# EAGLE design CAN_toolboard_redesign (EAGLE 9.6.2)
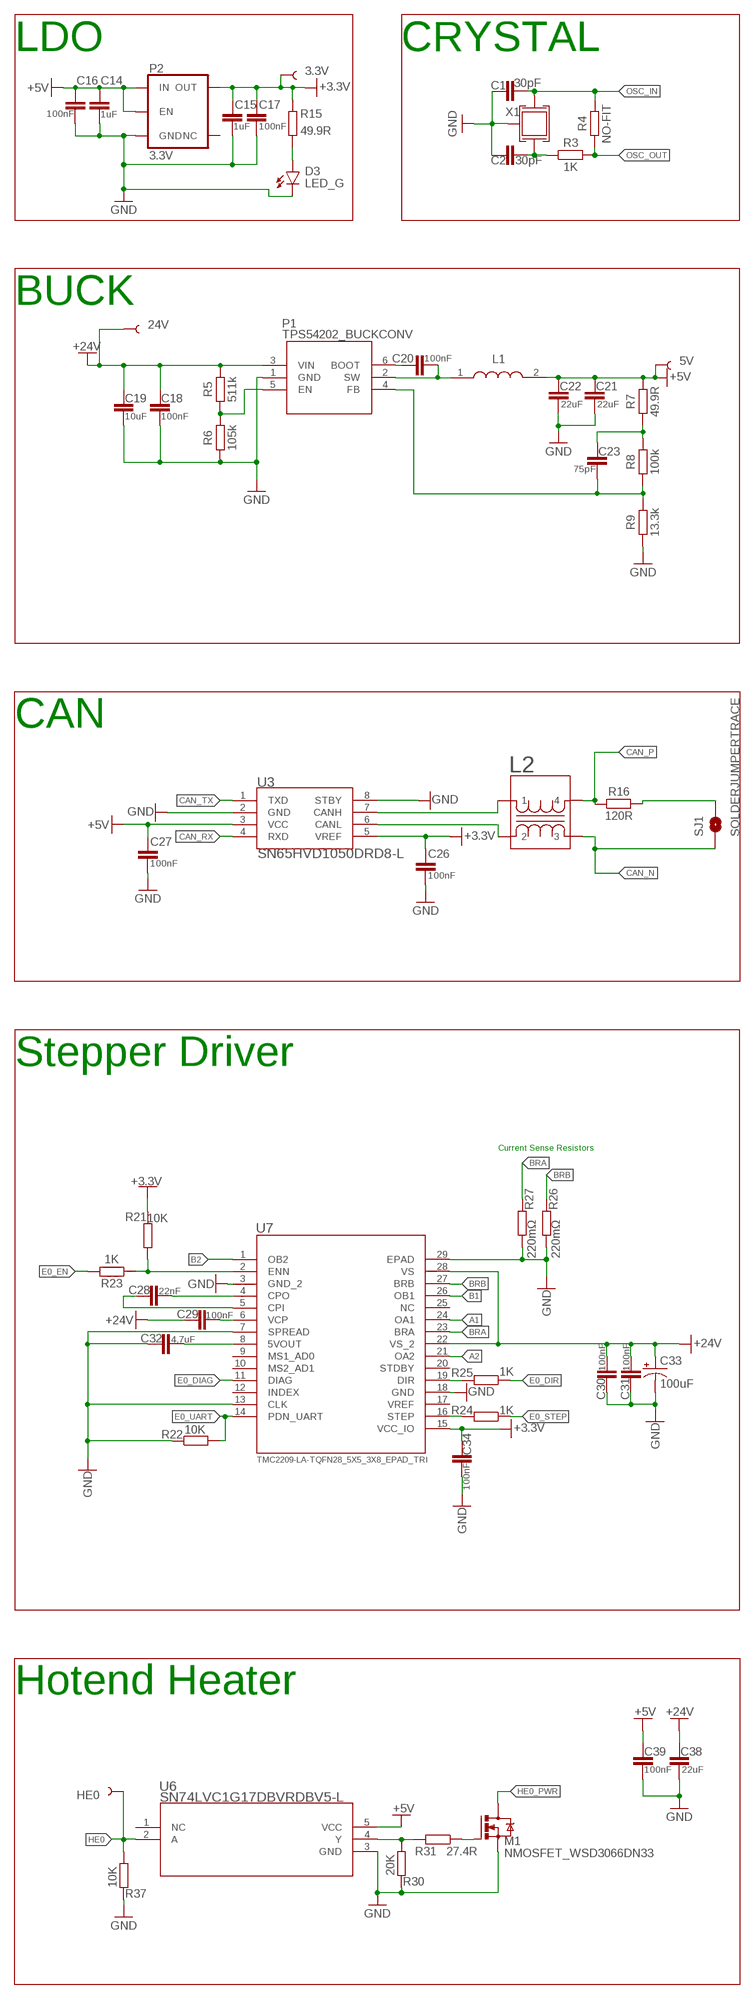
[diagram p0: schematic, sheet 1, part 1 of 2]
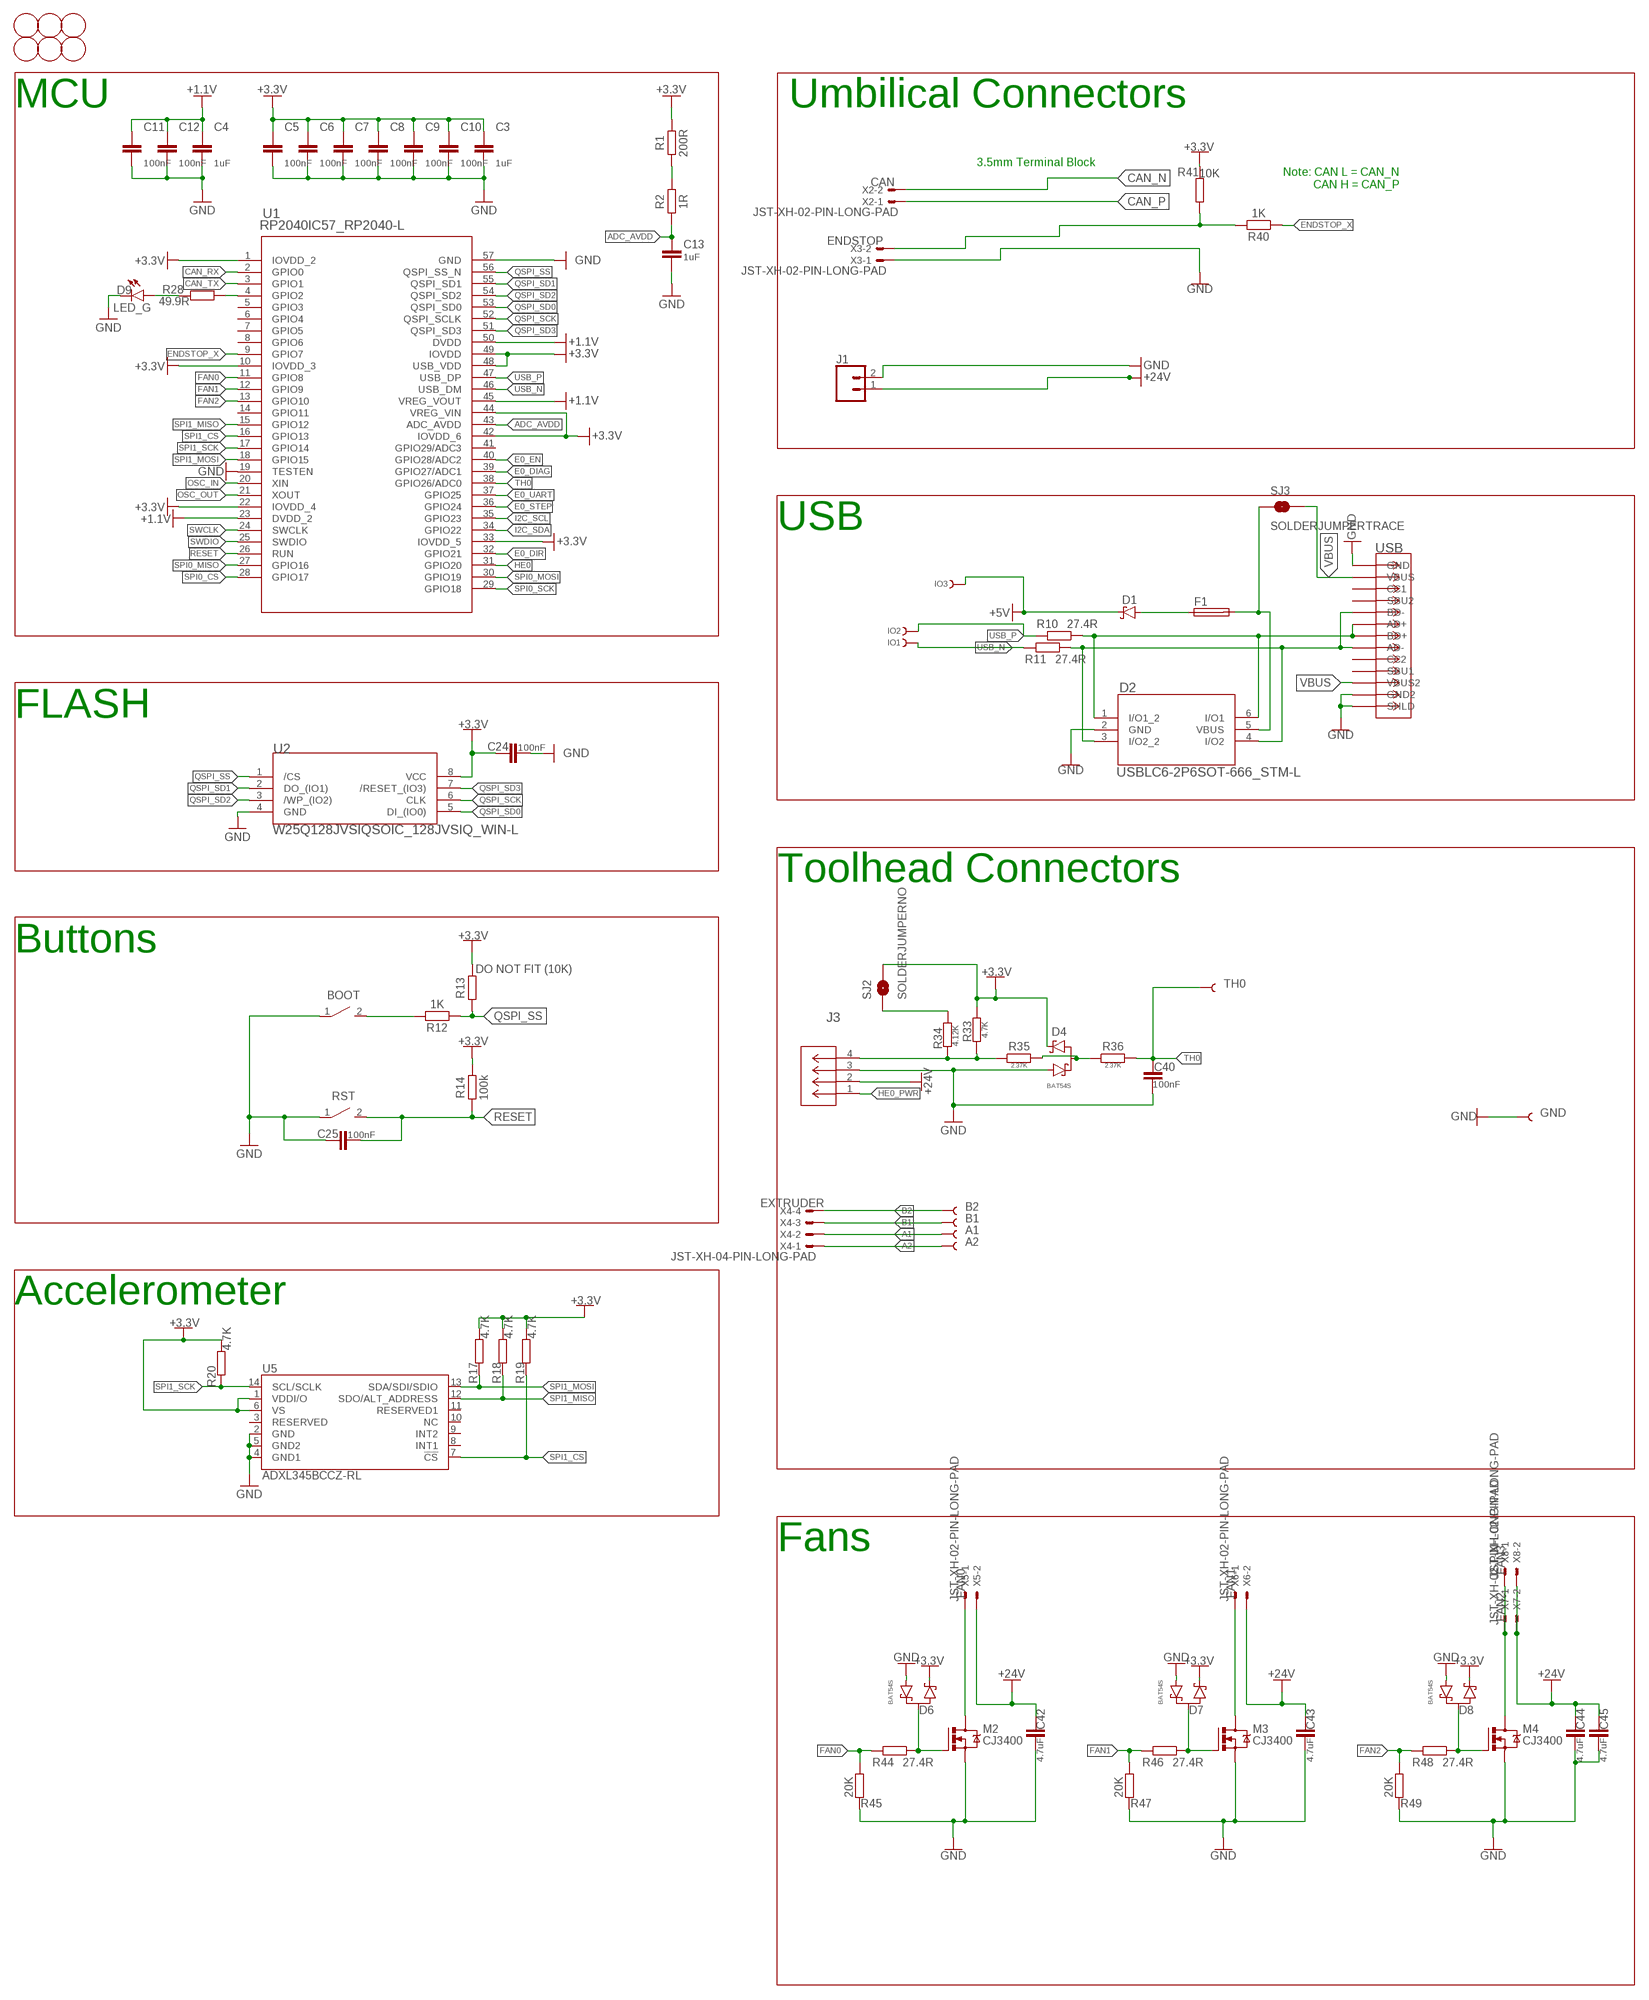
[diagram p1: schematic, sheet 1, part 2 of 2]

## Parts
3.3V  TEST-POINT3X4  [PAD.03X.04]
5V  TEST-POINT3X4  [PAD.03X.04]
24V  TEST-POINT3X4  [PAD.03X.04]
A1  TEST-POINT3X4  [PAD.03X.04]
A2  TEST-POINT3X4  [PAD.03X.04]
B1  TEST-POINT3X4  [PAD.03X.04]
B2  TEST-POINT3X4  [PAD.03X.04]
BOOT  B3U-1000P(M)-B  B3U-X000B3U-1000P(M)-B1000P(M)-B  [B3U-1000P(M)-B]
C1  30pF  C_CHIP-0402(1005-METRIC)  [CAPC1005X60]
C2  30pF  C_CHIP-0402(1005-METRIC)  [CAPC1005X60]
C3  1uF  C_CHIP-0402(1005-METRIC)  [CAPC1005X60]
C4  1uF  C_CHIP-0402(1005-METRIC)  [CAPC1005X60]
C5  100nF  C_CHIP-0402(1005-METRIC)  [CAPC1005X60]
C6  100nF  C_CHIP-0402(1005-METRIC)  [CAPC1005X60]
C7  100nF  C_CHIP-0402(1005-METRIC)  [CAPC1005X60]
C8  100nF  C_CHIP-0402(1005-METRIC)  [CAPC1005X60]
C9  100nF  C_CHIP-0402(1005-METRIC)  [CAPC1005X60]
C10  100nF  C_CHIP-0402(1005-METRIC)  [CAPC1005X60]
C11  100nF  C_CHIP-0402(1005-METRIC)  [CAPC1005X60]
C12  100nF  C_CHIP-0402(1005-METRIC)  [CAPC1005X60]
C13  1uF  C_CHIP-0402(1005-METRIC)  [CAPC1005X60]
C14  1uF  C_CHIP-0402(1005-METRIC)  [CAPC1005X60]
C15  1uF  C_CHIP-0402(1005-METRIC)  [CAPC1005X60]
C16  100nF  C_CHIP-0402(1005-METRIC)  [CAPC1005X60]
C17  100nF  C_CHIP-0402(1005-METRIC)  [CAPC1005X60]
C18  100nF  C_CHIP-0402(1005-METRIC)  [CAPC1005X60]
C19  10uF  C_CHIP-0603(1608-METRIC)  [CAPC1608X85]
C20  100nF  C_CHIP-0402(1005-METRIC)  [CAPC1005X60]
C21  22uF  C_CHIP-0805(2012-METRIC)  [CAPC2012X110]
C22  22uF  C_CHIP-0805(2012-METRIC)  [CAPC2012X110]
C23  75pF  C_CHIP-0402(1005-METRIC)  [CAPC1005X60]
C24  100nF  C_CHIP-0402(1005-METRIC)  [CAPC1005X60]
C25  100nF  C_CHIP-0402(1005-METRIC)  [CAPC1005X60]
C26  100nF  C_CHIP-0402(1005-METRIC)  [CAPC1005X60]
C27  100nF  C_CHIP-0402(1005-METRIC)  [CAPC1005X60]
C28  22nF  C_CHIP-0402(1005-METRIC)  [CAPC1005X60]
C29  100nF  C_CHIP-0402(1005-METRIC)  [CAPC1005X60]
C30  100nF  C_CHIP-0402(1005-METRIC)  [CAPC1005X60]
C31  100nF  C_CHIP-0402(1005-METRIC)  [CAPC1005X60]
C32  4.7uF  C_CHIP-0603(1608-METRIC)  [CAPC1608X85]
C33  100uF  100UF-POLAR-25V-20%(ELEC)  [PANASONIC_D]
C34  100nF  C_CHIP-0402(1005-METRIC)  [CAPC1005X60]
C38  22uF  C_CHIP-0805(2012-METRIC)  [CAPC2012X110]
C39  100nF  C_CHIP-0402(1005-METRIC)  [CAPC1005X60]
C40  100nF  C_CHIP-0402(1005-METRIC)  [CAPC1005X60]
C42  4.7uF  C_CHIP-0603(1608-METRIC)  [CAPC1608X85]
C43  4.7uF  C_CHIP-0603(1608-METRIC)  [CAPC1608X85]
C44  4.7uF  C_CHIP-0603(1608-METRIC)  [CAPC1608X85]
C45  4.7uF  C_CHIP-0603(1608-METRIC)  [CAPC1608X85]
D1  MBR0520LT1G  SCHOTTKY_MBR0520LT1GDO-219  [SODFL3718X115]
D2  USBLC6-2P6SOT-666_STM-L  [SOT-666_STM-L]
D3  LED_G  CHIP-FLAT-G_0603-0.35MM  [LEDC1608X35N_FLAT-G]
D4  BAT54S  [SOT23]
D6  BAT54S  [SOT23]
D7  BAT54S  [SOT23]
D8  BAT54S  [SOT23]
D9  LED_G  CHIP-FLAT-G_0603-0.35MM  [LEDC1608X35N_FLAT-G]
F1  FUSE_CHIP-0603(1608-METRIC)  [FUSC1608X60N]
FD1  FIDUCIAL  [FIDUCIAL_1MM]
FD2  FIDUCIAL  [FIDUCIAL_1MM]
FD3  FIDUCIAL  [FIDUCIAL_1MM]
FD4  FIDUCIAL  [FIDUCIAL_1MM]
FD5  FIDUCIAL  [FIDUCIAL_1MM]
FD6  FIDUCIAL  [FIDUCIAL_1MM]
GND  TEST-POINT3X4  [PAD.03X.04]
HE0  TEST-POINT3X4  [PAD.03X.04]
IO1  TEST-POINT3  [PAD.03X.03]
IO2  TEST-POINT3  [PAD.03X.03]
IO3  TEST-POINT3  [PAD.03X.03]
J1  CONN_023.5MM  [SCREWTERMINAL-3.5MM-2]
J3  430450400CON_430450400_MOL  [CON_430450400_MOL]
L1  ASPI-0630HI-100M-T157X7X4  [SMDRI74-680MT]
L2  ACM2012-201-2P-T002ACM2012_TDK  [ACM2012_TDK]
M1  NMOSFET_WSD3066DN33  [NMOSFET_WSD3066DN33]
M2  CJ3400  NMOSFET_BSS123_SOT23-GSD  [SOT23]
M3  CJ3400  NMOSFET_BSS123_SOT23-GSD  [SOT23]
M4  CJ3400  NMOSFET_BSS123_SOT23-GSD  [SOT23]
P1  TPS54202_BUCKCONV  [SOT-23-6]
P2  3.3V  V_REG_AP2112K-3.3V  [SOT23-5]
R1  200R  R_CHIP-0402(1005-METRIC)  [RESC1005X40]
R2  1R  R_CHIP-0402(1005-METRIC)  [RESC1005X40]
R3  1K  R_CHIP-0402(1005-METRIC)  [RESC1005X40]
R4  NO-FIT  R_CHIP-0402(1005-METRIC)  [RESC1005X40]
R5  511k  R_CHIP-0402(1005-METRIC)  [RESC1005X40]
R6  105k  R_CHIP-0402(1005-METRIC)  [RESC1005X40]
R7  49.9R  R_CHIP-0402(1005-METRIC)  [RESC1005X40]
R8  100k  R_CHIP-0402(1005-METRIC)  [RESC1005X40]
R9  13.3k  R_CHIP-0402(1005-METRIC)  [RESC1005X40]
R10  27.4R  R_CHIP-0402(1005-METRIC)  [RESC1005X40]
R11  27.4R  R_CHIP-0402(1005-METRIC)  [RESC1005X40]
R12  1K  R_CHIP-0402(1005-METRIC)  [RESC1005X40]
R13  DO NOT FIT (10K)  R_CHIP-0402(1005-METRIC)  [RESC1005X40]
R14  100k  R_CHIP-0402(1005-METRIC)  [RESC1005X40]
R15  49.9R  R_CHIP-0402(1005-METRIC)  [RESC1005X40]
R16  120R  R_CHIP-0402(1005-METRIC)  [RESC1005X40]
R17  4.7K  R_CHIP-0402(1005-METRIC)  [RESC1005X40]
R18  4.7K  R_CHIP-0402(1005-METRIC)  [RESC1005X40]
R19  4.7K  R_CHIP-0402(1005-METRIC)  [RESC1005X40]
R20  4.7K  R_CHIP-0402(1005-METRIC)  [RESC1005X40]
R21  10K  R_CHIP-0402(1005-METRIC)  [RESC1005X40]
R22  10K  R_CHIP-0402(1005-METRIC)  [RESC1005X40]
R23  1K  R_CHIP-0402(1005-METRIC)  [RESC1005X40]
R24  1K  R_CHIP-0402(1005-METRIC)  [RESC1005X40]
R25  1K  R_CHIP-0402(1005-METRIC)  [RESC1005X40]
R26  220mΩ  R_CHIP-0402(1005-METRIC)  [RESC1005X40]
R27  220mΩ  R_CHIP-0402(1005-METRIC)  [RESC1005X40]
R28  49.9R  R_CHIP-0402(1005-METRIC)  [RESC1005X40]
R30  20K  R_CHIP-0402(1005-METRIC)  [RESC1005X40]
R31  27.4R  R_CHIP-0402(1005-METRIC)  [RESC1005X40]
R33  4.7K  R_CHIP-0402(1005-METRIC)  [RESC1005X40]
R34  4.12K  R_CHIP-0402(1005-METRIC)  [RESC1005X40]
R35  2.37K  R_CHIP-0402(1005-METRIC)  [RESC1005X40]
R36  2.37K  R_CHIP-0402(1005-METRIC)  [RESC1005X40]
R37  10K  R_CHIP-0402(1005-METRIC)  [RESC1005X40]
R40  1K  R_CHIP-0402(1005-METRIC)  [RESC1005X40]
R41  10K  R_CHIP-0402(1005-METRIC)  [RESC1005X40]
R44  27.4R  R_CHIP-0402(1005-METRIC)  [RESC1005X40]
R45  20K  R_CHIP-0402(1005-METRIC)  [RESC1005X40]
R46  27.4R  R_CHIP-0402(1005-METRIC)  [RESC1005X40]
R47  20K  R_CHIP-0402(1005-METRIC)  [RESC1005X40]
R48  27.4R  R_CHIP-0402(1005-METRIC)  [RESC1005X40]
R49  20K  R_CHIP-0402(1005-METRIC)  [RESC1005X40]
RST  B3U-1000P(M)-B  B3U-X000B3U-1000P(M)-B1000P(M)-B  [B3U-1000P(M)-B]
SJ1  SOLDERJUMPERTRACE  [SJ_2S-TRACE]
SJ2  SOLDERJUMPERNO  [SJ_2S-NO]
SJ3  SOLDERJUMPERTRACE  [SJ_2S-TRACE]
TH0  TEST-POINT3X4  [PAD.03X.04]
U1  RP2040IC57_RP2040-L  [IC57_RP2040-L]
U2  W25Q128JVSIQSOIC_128JVSIQ_WIN-L  [SOIC_128JVSIQ_WIN-L]
U3  SN65HVD1050DRD8-L  [D8-L]
U5  ADXL345BCCZ-RL  [ADXL345_LGA14]
U6  SN74LVC1G17DBVRDBV5-L  [DBV5-L]
U7  TMC2209-LA-TQFN28_5X5_3X8_EPAD_TRI  [QFN28_5X5_3X8_EPAD_TRI]
USB  USB-C(DX07S016JA1R1500)  [CONN12_016JA1R1500_JAE]
X1  CRYSTAL_TAXM12M4RLBDDT2T_3225  [CRYSTAL_3225]
X2  JST-XH-02-PIN-LONG-PAD  [JST-XH-02-PACKAGE-LONG-PAD]
X3  JST-XH-02-PIN-LONG-PAD  [JST-XH-02-PACKAGE-LONG-PAD]
X4  JST-XH-04-PIN-LONG-PAD  [JST-XH-04-PACKAGE-LONG-PAD]
X5  JST-XH-02-PIN-LONG-PAD  [JST-XH-02-PACKAGE-LONG-PAD]
X6  JST-XH-02-PIN-LONG-PAD  [JST-XH-02-PACKAGE-LONG-PAD]
X7  JST-XH-02-PIN-LONG-PAD  [JST-XH-02-PACKAGE-LONG-PAD]
X8  JST-XH-02-PIN-LONG-PAD  [JST-XH-02-PACKAGE-LONG-PAD]

## Nets
+1.1V [POWER]: C4.1 C11.1 C12.1 U1.23(DVDD_2) U1.45(VREG_VOUT) U1.50(DVDD)
+3.3V [POWER]: 3.3V.P$1 C3.1 C5.1 C6.1 C7.1 C8.1 C9.1 C10.1 C15.1 C17.1 C24.1 C26.1 C34.1 D4.2 D6.2 D7.2 D8.2 P2.5(OUT) R1.2 R13.2 R14.2 R15.2 R17.2 R18.2 R19.2 R20.2 R21.1 R33.2 R41.1 SJ2.2 U1.1(IOVDD_2) U1.10(IOVDD_3) U1.22(IOVDD_4) U1.33(IOVDD_5) U1.42(IOVDD_6) U1.44(VREG_VIN) U1.48(USB_VDD) U1.49(IOVDD) U2.8(VCC) U3.5(VREF) U5.1(VDDI/O) U5.6(VS) U7.15(VCC_IO)
+5V [POWER]: 5V.P$1 C14.1 C16.1 C21.1 C22.1 C27.1 C39.1 D1.1(C) IO3.P$1 L1.2 P2.1(IN) P2.3(EN) R7.2 U3.3(VCC) U6.5(VCC)
+24V [POWER]: 24V.P$1 C18.1 C19.1 C29.1 C30.2 C31.2 C33.+ C38.1 C42.1 C43.1 C44.1 C45.1 J1.1 J3.2 P1.3(VIN) R5.2 U7.22(VS_2) U7.28(VS) X5.2 X6.2 X7.2 X8.2
A1 [POWER]: A1.P$1 U7.24(OA1) X4.2
A2 [POWER]: A2.P$1 U7.21(OA2) X4.1
ADC_AVDD: C13.1 R2.1 U1.43(ADC_AVDD)
ADC_R: R1.1 R2.2
B1 [POWER]: B1.P$1 U7.26(OB1) X4.3
B2 [POWER]: B2.P$1 U7.1(OB2) X4.4
BCBOOT: C20.1 P1.6(BOOT)
BRA: R27.2 U7.23(BRA)
BRB: R26.2 U7.27(BRB)
CAN1_N [DIFF]: L2.2 U3.6(CANL)
CAN1_P [DIFF]: L2.1 U3.7(CANH)
CAN_N [DIFF]: L2.3 SJ1.1 X2.2
CAN_P [DIFF]: L2.4 R16.1 X2.1
CAN_RX: U1.2(GPIO0) U3.4(RXD)
CAN_TX: U1.3(GPIO1) U3.1(TXD)
CNT: R16.2 SJ1.2
DIR: R25.2 U7.19(DIR)
E0_DIAG: U1.39(GPIO27/ADC1) U7.11(DIAG)
E0_DIR: R25.1 U1.32(GPIO21)
E0_EN: R23.2 U1.40(GPIO28/ADC2)
E0_STEP: R24.1 U1.36(GPIO24)
E0_UART: R22.2 U1.37(GPIO25) U7.14(PDN_UART)
ENDSTOP_X: R40.1 U1.9(GPIO7)
EX: R40.2 R41.2 X3.2
FAN0: R44.2 R45.2 U1.11(GPIO8)
FAN0G: D6.3 M2.1(G) R44.1
FAN1: R46.2 R47.2 U1.12(GPIO9)
FAN1D: M3.3(D) X6.1
FAN1G: D7.3 M3.1(G) R46.1
FAN2: R48.2 R49.2 U1.13(GPIO10)
FAN2G: D8.3 M4.1(G) R48.1
GND [POWER]: BOOT.1 C1.2 C2.1 C3.2 C4.2 C5.2 C6.2 C7.2 C8.2 C9.2 C10.2 C11.2 C12.2 C13.2 C14.2 C15.2 C16.2 C17.2 C18.2 C19.2 C21.2 C22.2 C24.2 C25.1 C26.2 C27.2 C30.1 C31.1 C32.1 C33.- C34.2 C38.2 C39.2 C40.2 C42.2 C43.2 C44.2 C45.2 D2.2(GND) D3.C D4.1 D6.1 D7.1 D8.1 D9.C GND.P$1 J1.2 J3.3 M1.P$1(S) M1.P$2(S) M1.P$3(S) M2.2(S) M3.2(S) M4.2(S) P1.1(GND) P2.2(GND) R6.1 R9.1 R22.1 R26.1 R27.1 R30.1 R37.1 R45.1 R47.1 R49.1 RST.1 U1.19(TESTEN) U1.57(GND) U2.4(GND) U3.2(GND) U3.8(STBY) U5.2(GND) U5.4(GND1) U5.5(GND2) U6.3(GND) U7.3(GND_2) U7.7(SPREAD) U7.13(CLK) U7.18(GND) U7.29(EPAD) USB.1(GND) USB.12(GND2) USB.13(SHLD) USB.14(SHLD) USB.15(SHLD) USB.16(SHLD) USB.18(SHLD) USB.19(SHLD) USB.20(SHLD) USB.21(SHLD) USB.24(SHLD) USB.25(SHLD) USB.26(SHLD) USB.27(SHLD) USB.28(SHLD) USB.29(SHLD) USB.37(SHLD) USB.39(SHLD) USB.41(SHLD) USB.43(SHLD) X1.P$2(GND) X1.P$4(GND) X3.1
GPIOLED: D9.A R28.1
HE0: HE0.P$1 R37.2 U1.31(GPIO20) U6.2(A)
HE0_PWR [POWER]: J3.1 M1.P$5(D) M1.P$6(D) M1.P$7(D) M1.P$8(D) M1.P$9(D)
HE0A: R30.2 R31.2 U6.4(Y)
HE0B: M1.P$4(G) R31.1
I2C_SCL: U1.35(GPIO23)
I2C_SDA: U1.34(GPIO22)
LDOLED: D3.A R15.1
LED: R28.2 U1.4(GPIO2)
N$1: M2.3(D) X5.1
N$2: M4.3(D) X7.1 X8.1
OSC_IN: C1.1 R4.2 U1.20(XIN) X1.P$1(P1)
OSC_OUT: R3.2 R4.1 U1.21(XOUT)
QSPI_SCK: U1.52(QSPI_SCLK) U2.6(CLK)
QSPI_SD0: U1.53(QSPI_SD0) U2.5(DI_(IO0))
QSPI_SD1: U1.55(QSPI_SD1) U2.2(DO_(IO1))
QSPI_SD2: U1.54(QSPI_SD2) U2.3(/WP_(IO2))
QSPI_SD3: U1.51(QSPI_SD3) U2.7(/RESET_(IO3))
QSPI_SS: R12.1 R13.1 U1.56(QSPI_SS_N) U2.1(/CS)
RESET: C25.2 R14.1 RST.2 U1.26(RUN)
SPI0_CS: U1.28(GPIO17)
SPI0_MISO: U1.27(GPIO16)
SPI0_MOSI: U1.30(GPIO19)
SPI0_SCK: U1.29(GPIO18)
SPI1_CS: R19.1 U1.16(GPIO13) U5.7(!CS)
SPI1_MISO: R18.1 U1.15(GPIO12) U5.12(SDO/ALT_ADDRESS)
SPI1_MOSI: R17.1 U1.18(GPIO15) U5.13(SDA/SDI/SDIO)
SPI1_SCK: R20.1 U1.17(GPIO14) U5.14(SCL/SCLK)
STEP: R24.2 U7.16(STEP)
SWB: BOOT.2 R12.2
SWCLK: U1.24(SWCLK)
SWDIO: U1.25(SWDIO)
TH0: C40.1 R36.2 TH0.P$1 U1.38(GPIO26/ADC0)
TH0A: J3.4 R33.1 R34.1 R35.1
TH0B: D4.3 R35.2 R36.1
TH0C: R34.2 SJ2.1
TMC5V: C32.2 U7.8(5VOUT)
TMCCPI: C28.1 U7.5(CPI)
TMCCPO: C28.2 U7.4(CPO)
TMCENN: R21.2 R23.1 U7.2(ENN)
TMCVCP: C29.2 U7.6(VCP)
USB1_N [DIFF]: D2.3(I/O2_2) D2.4(I/O2) R11.1 USB.5(BD-) USB.8(AD-)
USB1_P [DIFF]: D2.1(I/O1_2) D2.6(I/O1) R10.1 USB.6(AD+) USB.7(BD+)
USB_N [DIFF]: IO1.P$1 R11.2 U1.46(USB_DM)
USB_P [DIFF]: IO2.P$1 R10.2 U1.47(USB_DP)
VBUS [POWER]: SJ3.2 USB.2(VBUS) USB.11(VBUS2)
VBUS1 [POWER]: D2.5(VBUS) F1.2 SJ3.1
VBUS2 [POWER]: D1.2(A) F1.1
VRC: C23.1 R7.1 R8.2
VREGEN: P1.5(EN) R5.1 R6.2
VREGFB: C23.2 P1.4(FB) R8.1 R9.2
VREGO: C20.2 L1.1 P1.2(SW)
XR: C2.2 R3.1 X1.P$3(P2)
Unconnected: P2.4(NC) U1.5(GPIO3) U1.6(GPIO4) U1.7(GPIO5) U1.8(GPIO6) U1.14(GPIO11) U1.41(GPIO29/ADC3) U5.3(RESERVED) U5.8(INT1) U5.9(INT2) U5.10(NC) U5.11(RESERVED1) U6.1(NC) U7.9(MS1_AD0) U7.10(MS2_AD1) U7.12(INDEX) U7.17(VREF) U7.20(STDBY) U7.25(NC) USB.3(CC1) USB.4(SBU2) USB.9(CC2) USB.10(SBU1)

## Notes on the sheet
- LDO | CRYSTAL | MCU | Umbilical Connectors
- 3.5mm Terminal Block
- Note: CAN L = CAN_N
  CAN H = CAN_P
- BUCK
- USB
- FLASH
- CAN
- Toolhead Connectors
- Buttons
- Stepper Driver
- Current Sense Resistors
- Accelerometer
- Fans
- Hotend Heater

## Library data of the parts
3.3V 5V 24V A1 A2 B1 B2 GND HE0 IO1-IO3 TH0 = SparkFun-Connectors:TEST-POINT: SparkFun Test Points Bare copper test points for troubleshooting or In-Circuit-Testing. These are used by our Production team for verifying production board runs using pogo-pins on test beds. SparkFun Products: SparkFun LSM9DS1 Breakout <https://www.sparkfun.com/products/13284> SparkFun PSOC <https://www.sparkfun.com/products/13714> SparkFun Load Cell Amplifier <https://www.sparkfun.com/products/13879>
BOOT RST = Switch:B3U-X000: Ultra-small Tactile Switch Contact form : SPST-NO Datasheet <https://omronfs.omron.com/en_US/ecb/products/pdf/en-b3u.pdf>; CATEGORY: SWITCH; DESCRIPTION: Ultra-small Surface-mounting Tactile Switches with High Contact Reliability; LCSCPN#: C231329; MANUFACTURER: OMRON; OPERATING_TEMPERATURE: -25°C to +70°C at 60%RH max; PART_STATUS: ACTIVE; SERIES: B3U; TYPE: Tactile
C1 C2 = Fracktal Misc Lib:C: Capacitor - Generic; CATEGORY: Capacitor; LCSCPN#: C1570
C3 C4 C13-C15 = Fracktal Misc Lib:C: Capacitor - Generic; CATEGORY: Capacitor; LCSCPN#: C52923
C5-C12 C16-C18 C20 C24-C27 C29-C31 C34 C39 C40 = Fracktal Misc Lib:C: Capacitor - Generic; CATEGORY: Capacitor; LCSCPN#: C307331
C19 = Fracktal Misc Lib:C: Capacitor - Generic; CATEGORY: Capacitor; LCSCPN#: C194427
C21 C22 C38 = Fracktal Misc Lib:C: Capacitor - Generic; CATEGORY: Capacitor; LCSCPN#: C338080
C23 = Fracktal Misc Lib:C: Capacitor - Generic; CATEGORY: Capacitor; LCSCPN#: C37809
C28 = Fracktal Misc Lib:C: Capacitor - Generic; CATEGORY: Capacitor; LCSCPN#: C1532
C32 C42-C45 = Fracktal Misc Lib:C: Capacitor - Generic; CATEGORY: Capacitor; LCSCPN#: C162274
C33 = Fracktal Misc Lib:100UF-POLAR: 100µF polarized capacitors A capacitor is a passive two-terminal electrical component used to store electrical energy temporarily in an electric field.; LCSCPN#: C128464; PROD_ID: CAP-12547
D1 = Diode:SCHOTTKY_: Schottky Diode - Popular parts; CATEGORY: Diode; DESCRIPTION: DIODE SCHOTTKY 20V 500MA SOD123; MANUFACTURER: ON Semiconductor; MPN: MBR0520LT1G; SUB-CATEGORY: Schottky
D2 = 2023-04-02_04-17-07_Library:USBLC6-2P6; COPYRIGHT: Copyright (C) 2023 Ultra Librarian. All rights reserved.; LCSCPN#: C2827693; MANUFACTURER_PART_NUMBER: USBLC6-2P6; MFR_NAME: STMicroelectronics
D3 D9 = LED:CHIP-FLAT-G; CATEGORY: LED; COLOR: GREEN; DESCRIPTION: CHIP LED FLAT; LCSCPN#: C72043; SUB-CATEGORY: CHIP; TYPE: FLAT_TOP; VALUE: LED_GREEN
D4 D6-D8 = Fracktal Misc Lib:BAT54S; LCSCPN#: C47546
F1 = Circuit-Protection:FUSE: Fuse - Generic; CATEGORY: Circuit-Protection; LCSCPN#: C261937; SUB-CATEGORY: Fuse
FD1-FD6 = CDC Library:FIDUCIAL: For use by pick and place machines to calibrate the vision/machine, 1mm By microbuilder.eu
J1 = SparkFun-Connectors:CONN_02: Multi connection point. Often used as Generic Header-pin footprint for 0.1 inch spaced/style header connections On any of the 0.1 inch spaced packages, you can populate with these: Break Away Headers - Straight <https://www.sparkfun.com/products/116> (PRT-00116) Break Away Male Headers - Right Angle <https://www.sparkfun.com/products/553> (PRT-00553) Female Headers <https://www.sparkfun.com/products/115> (PRT-00115) Break Away Headers - Machine Pin <https://www.sparkfun.com/products/117> (PRT-00117) Break Away Female Headers - Swiss Machine Pin <https://www.sparkfun.com/products/743> (PRT-00743) For SCREWTERMINALS and SPRING TERMINALS visit here: Screw Terimnals on SparkFun.com <https://www.sparkfun.com/search/results?term=Screw+Terminals> (5mm/3.5mm/2.54mm spacing) This device is also useful as a general connection point to wire up your design to another part of your project. Our various solder wires solder well into these plated through hole pads. Hook-Up Wire - Assortment (Stranded, 22 AWG) <https://www.sparkfun.com/products/11375> (PRT-11375) Hook-Up Wire - Assortment (Solid Core, 22 AWG) <https://www.sparkfun.com/products/11367> (PRT-11367) View the entire wire category on our website here <https://www.sparkfun.com/categories/141> Special notes: Molex polarized connector foot print use with: PRT-08233 with associated crimp pins and housings. 2.54_SCREWTERM for use with PRT-10571. 3.5mm Screw Terminal footprints for PRT-08084 5mm Screw Terminal footprints for use with PRT-08432; PROD_ID: CONN-08399
J3 = Fracktal Misc Lib:430450400; COPYRIGHT: Copyright (C) 2023 Ultra Librarian. All rights reserved.; MANUFACTURER_PART_NUMBER: 430450400; MFR_NAME: Molex Connector Corporation
L1 = Fracktal Misc Lib:ASPI-0630HI-100M-T15: Inductor Power Molded Wirewound 10uH 20% 3A 105mOhm DCR T/R Source: Datasheet <https://www.arrow.com/en/products/aspi-0630hi-100m-t15/abracon>; LCSCPN#: C3000391
L2 = 2023-04-02_14-21-16_Library:ACM2012-201-2P-T002; COPYRIGHT: Copyright (C) 2023 Ultra Librarian. All rights reserved.; LCSCPN#: C3029258; MANUFACTURER_PART_NUMBER: ACM2012-201-2P-T002; MFR_NAME: TDK
M1 = Fracktal Misc Lib:NMOSFET_WSD3066DN33; LCSCPN#: C148386
M2-M4 = Transistor:NMOSFET_: N-Channel MOSFET - Popular parts; CATEGORY: Transistor; DESCRIPTION: MOSFET N-CH 100V 0.17A SOT-23; DRAIN_CURRENT: 170mA; LCSCPN#: C19019; MANUFACTURER: ON Semiconductor; MPN: BSS123L; OPERATING_TEMP: -55°C ~ 150°C; PART_STATUS: Active; ROHS_COMPLIANT: Yes; SUB-CATEGORY: MOSFET; THERMALLOSS: 360mW; TYPE: N-Channel; VALUE: BSS123
P1 = Fracktal Misc Lib:TPS54202_BUCKCONV; LCSCPN#: C191884
P2 = SparkFun-IC-Power:V_REG_AP2112: AP2112 - 600mA CMOS LDO Regulator w/ Enable The AP2112 is CMOS process low dropout linear regulator with enable function, the regulator delivers a guaranteed 600mA (min.) continuous load current. Features Output Voltage Accuracy: ±1.5% Output Current: 600mA (Min.) Foldback Short Current Protection: 50mA Enable Function to Turn ON/OFF VOUT Low Dropout Voltage (3.3V): 250mV (Typ.) @IOUT=600mA Excellent Load Regulation: 0.2%/A (Typ.) Excellent Line Regulation: 0.02%/V (Typ.) Low Quiescent Current: 55μA (Typ.) Low Standby Current: 0.01μA (Typ.) Low Output Noise: 50μVRMS PSRR: 100Hz -65dB, 1kHz -65dB OTSD Protection Stable with 1.0μF Flexible Cap: Ceramic, Tantalum and Aluminum Electrolytic Operation Temperature Range: -40°C to 85°C ESD: MM 400V, HBM 4000V; LCSCPN#: C51118; PROD_ID: VREG-12457
R1 = Fracktal Misc Lib:R: Resistor Fixed - Generic; CATEGORY: Resistor; LCSCPN#: C25087; SUB-CATEGORY: Fixed
R2 = Fracktal Misc Lib:R: Resistor Fixed - Generic; CATEGORY: Resistor; LCSCPN#: C25086; SUB-CATEGORY: Fixed
R3 R12 R23-R25 R40 = Fracktal Misc Lib:R: Resistor Fixed - Generic; CATEGORY: Resistor; LCSCPN#: C25543; SUB-CATEGORY: Fixed
R4 R13 = Fracktal Misc Lib:R: Resistor Fixed - Generic; CATEGORY: Resistor; LCSCPN#: NO-FIT; SUB-CATEGORY: Fixed
R5 = Fracktal Misc Lib:R: Resistor Fixed - Generic; CATEGORY: Resistor; LCSCPN#: C3037035; SUB-CATEGORY: Fixed
R6 = Fracktal Misc Lib:R: Resistor Fixed - Generic; CATEGORY: Resistor; LCSCPN#: C2933067; SUB-CATEGORY: Fixed
R7 R15 R28 = Fracktal Misc Lib:R: Resistor Fixed - Generic; CATEGORY: Resistor; LCSCPN#: C25120; SUB-CATEGORY: Fixed
R8 R14 = Fracktal Misc Lib:R: Resistor Fixed - Generic; CATEGORY: Resistor; LCSCPN#: C25741; SUB-CATEGORY: Fixed
R9 = Fracktal Misc Lib:R: Resistor Fixed - Generic; CATEGORY: Resistor; LCSCPN#: C2974007; SUB-CATEGORY: Fixed
R10 R11 R31 R44 R46 R48 = Fracktal Misc Lib:R: Resistor Fixed - Generic; CATEGORY: Resistor; LCSCPN#: C31439; SUB-CATEGORY: Fixed
R16 = Fracktal Misc Lib:R: Resistor Fixed - Generic; CATEGORY: Resistor; LCSCPN#: C25079; SUB-CATEGORY: Fixed
R17-R20 R33 = Fracktal Misc Lib:R: Resistor Fixed - Generic; CATEGORY: Resistor; LCSCPN#: C304616; SUB-CATEGORY: Fixed
R21 R22 R37 R41 = Fracktal Misc Lib:R: Resistor Fixed - Generic; CATEGORY: Resistor; LCSCPN#: C25744; SUB-CATEGORY: Fixed
R26 R27 = Fracktal Misc Lib:R: Resistor Fixed - Generic; CATEGORY: Resistor; LCSCPN#: C705474; SUB-CATEGORY: Fixed
R30 R45 R47 R49 = Fracktal Misc Lib:R: Resistor Fixed - Generic; CATEGORY: Resistor; LCSCPN#: C25765; SUB-CATEGORY: Fixed
R34 = Fracktal Misc Lib:R: Resistor Fixed - Generic; CATEGORY: Resistor; LCSCPN#: C227106; SUB-CATEGORY: Fixed
R35 R36 = Fracktal Misc Lib:R: Resistor Fixed - Generic; CATEGORY: Resistor; LCSCPN#: C425373; SUB-CATEGORY: Fixed
SJ1-SJ3 = SparkFun-Retired:SOLDERJUMPER: Solder Jumper Standard SMD solder jumper. Used to automate production. Two varients : Normally Open and Normally Closed are the same, but have different paste layers. NC will have a large amount of paste and should jumper during reflow.
U1 = 2023-03-26_17-59-48_Library:RP2040; COPYRIGHT: Copyright (C) 2023 Ultra Librarian. All rights reserved.; LCSCPN#: C2040; MANUFACTURER_PART_NUMBER: RP2040; MFR_NAME: Raspberry Pi
U2 = Fracktal Misc Lib:W25Q128JVSIQ; COPYRIGHT: Copyright (C) 2023 Ultra Librarian. All rights reserved.; LCSCPN#: C97521; MANUFACTURER_PART_NUMBER: W25Q128JVSIQ; MFR_NAME: Winbond
U3 = Fracktal Misc Lib:SN65HVD1050DR; COPYRIGHT: Copyright (C) 2023 Ultra Librarian. All rights reserved.; LCSCPN#: C14019; MANUFACTURER_PART_NUMBER: SN65HVD1050DR; MFR_NAME: Texas Instruments
U5 = Sensor:ADXL345: Digital Accelerometer Datasheet <https://www.analog.com/media/en/technical-documentation/data-sheets/ADXL345.pdf>; CATEGORY: SENSOR; DESCRIPTION: Digital Accelerometer; LCSCPN#: C9667; MANUFACTURER: ANALOG DEVICES; MPN: ADXL345BCCZ-RL; OPERATING_TEMPERATURE: −55°C to +105°C; PART_STATUS: ACTIVE; ROHS_COMPLIANT: RoHS Compliant; SERIES: ADXL345; SUB-CATEGORY: Accelerometer; TYPE: 3-Axis Digital MEMS Accelerometer
U6 = 2023-03-28_15-41-49_Library:SN74LVC1G17DBVR; COPYRIGHT: Copyright (C) 2023 Ultra Librarian. All rights reserved.; LCSCPN#: C7836; MANUFACTURER_PART_NUMBER: SN74LVC1G17DBVR; MFR_NAME: Texas Instruments
U7 = Fracktal Misc Lib:TMC2209-LA-T; COPYRIGHT: Copyright (C) 2023 Ultra Librarian. All rights reserved.; DIGI-KEY_PART_NUMBER_1: 1460-1398-2-ND; DIGI-KEY_PART_NUMBER_2: 1460-1398-1-ND; DIGI-KEY_PART_NUMBER_3: 1460-1398-6-ND; DIGI-KEY_PART_NUMBER_4: 1460-TMC2209-LA-TTR-NDL; LCSCPN#: C2150710; MANUFACTURER_PART_NUMBER: TMC2209-LA-T; MFR_NAME: Trinamic
USB = CDC Library:USB-C(DX07S016JA1R1500); BUILT_BY: EMA_Matt; COPYRIGHT: Copyright (C) 2018 Accelerated Designs. All rights reserved; DATASHEET: https://www.digikey.com/product-detail/en/DX07S016JA1R1500/670-DX07S016JA1R1500CT-ND/11586676?utm_campaign=buynow&WT.z_cid=ref_octopart_dkc_buynow&utm_medium=aggregator&curr=usd&site=us&utm_source=octopart; LCSCPN#: C709357; MANUFACTURER_PART_NUMBER: DX07S016JA1R1500; SOURCELIBRARY: JAE_Electronics_2020-03-30; VENDOR: JAE Electronics
X1 = Fracktal Misc Lib:CRYSTAL_TAXM12M4RLBDDT2T_3225; LCSCPN#: C133334
X2 X3 X5-X8 = Rembrandt Electronics - JST XH Connectors v1-0:JST-XH-02-PIN: JST XH Connector 2 Pin Wire to board connector. Pitch: 2,54 mm, (0.100") Number of pins: 2 Created by Rembrandt Electronics www.rembrandtelectronics.com
X4 = Rembrandt Electronics - JST XH Connectors v1-0:JST-XH-04-PIN: JST XH Connector 2 Pin Wire to board connector. Pitch: 2,54 mm, (0.100") Number of pins: 4 Created by Rembrandt Electronics www.rembrandtelectronics.com

## Board
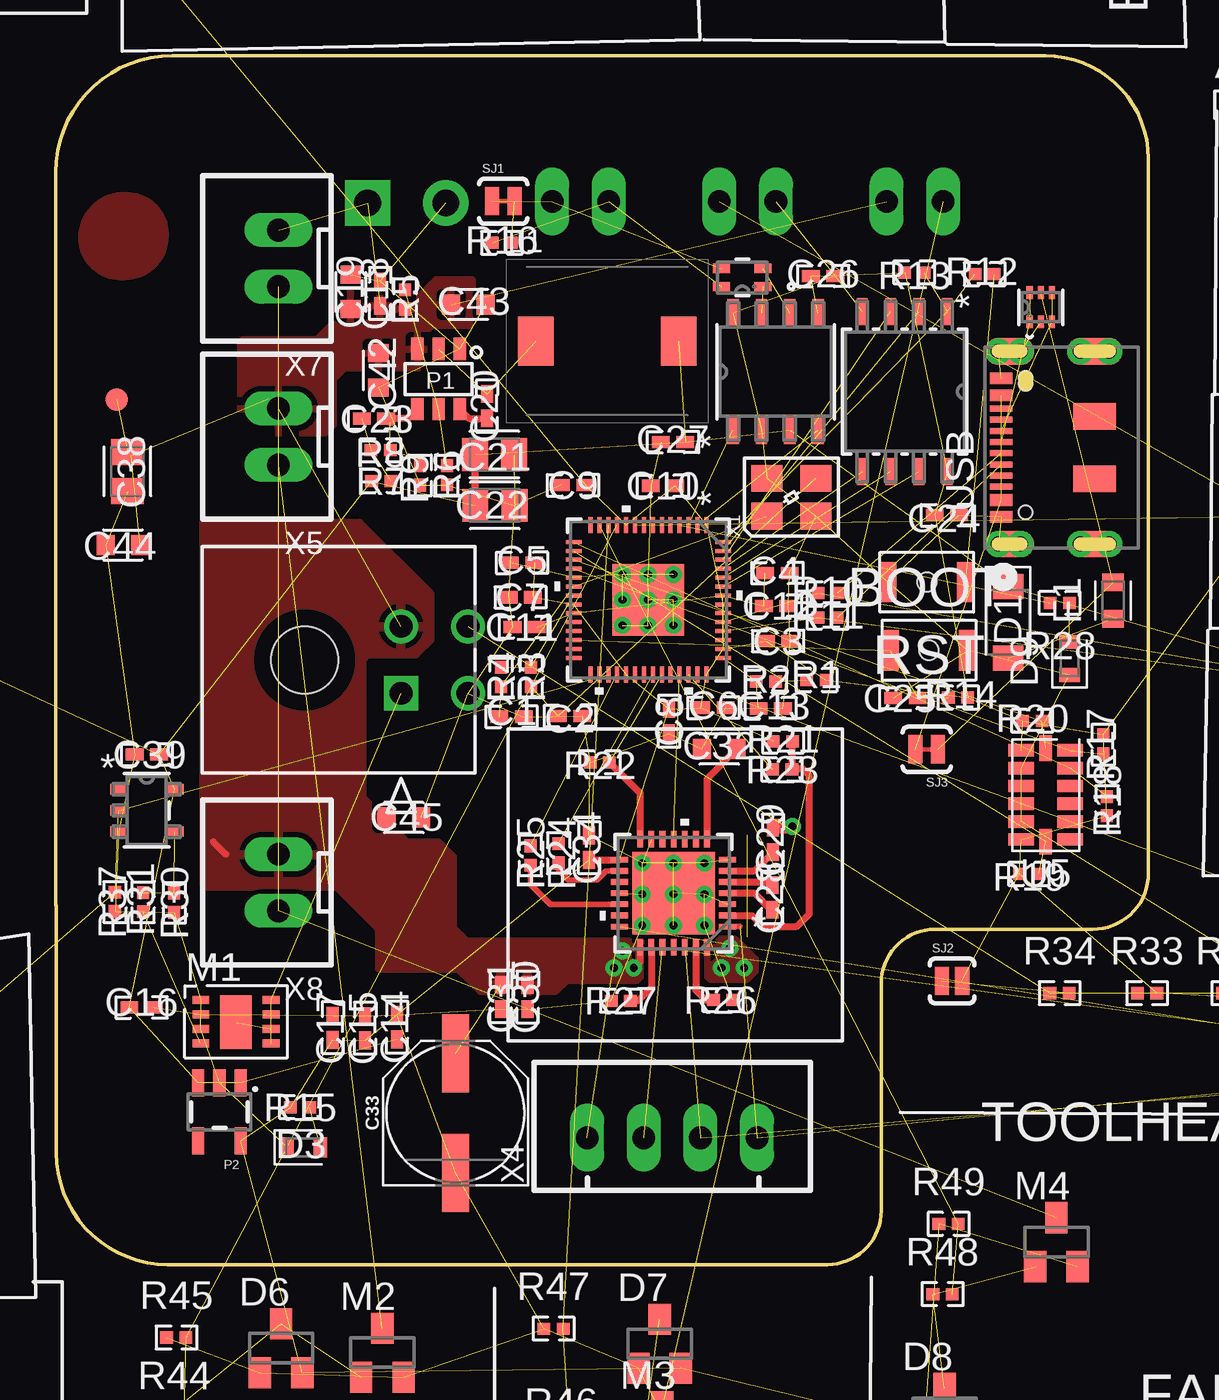
[diagram p2: board, top side]
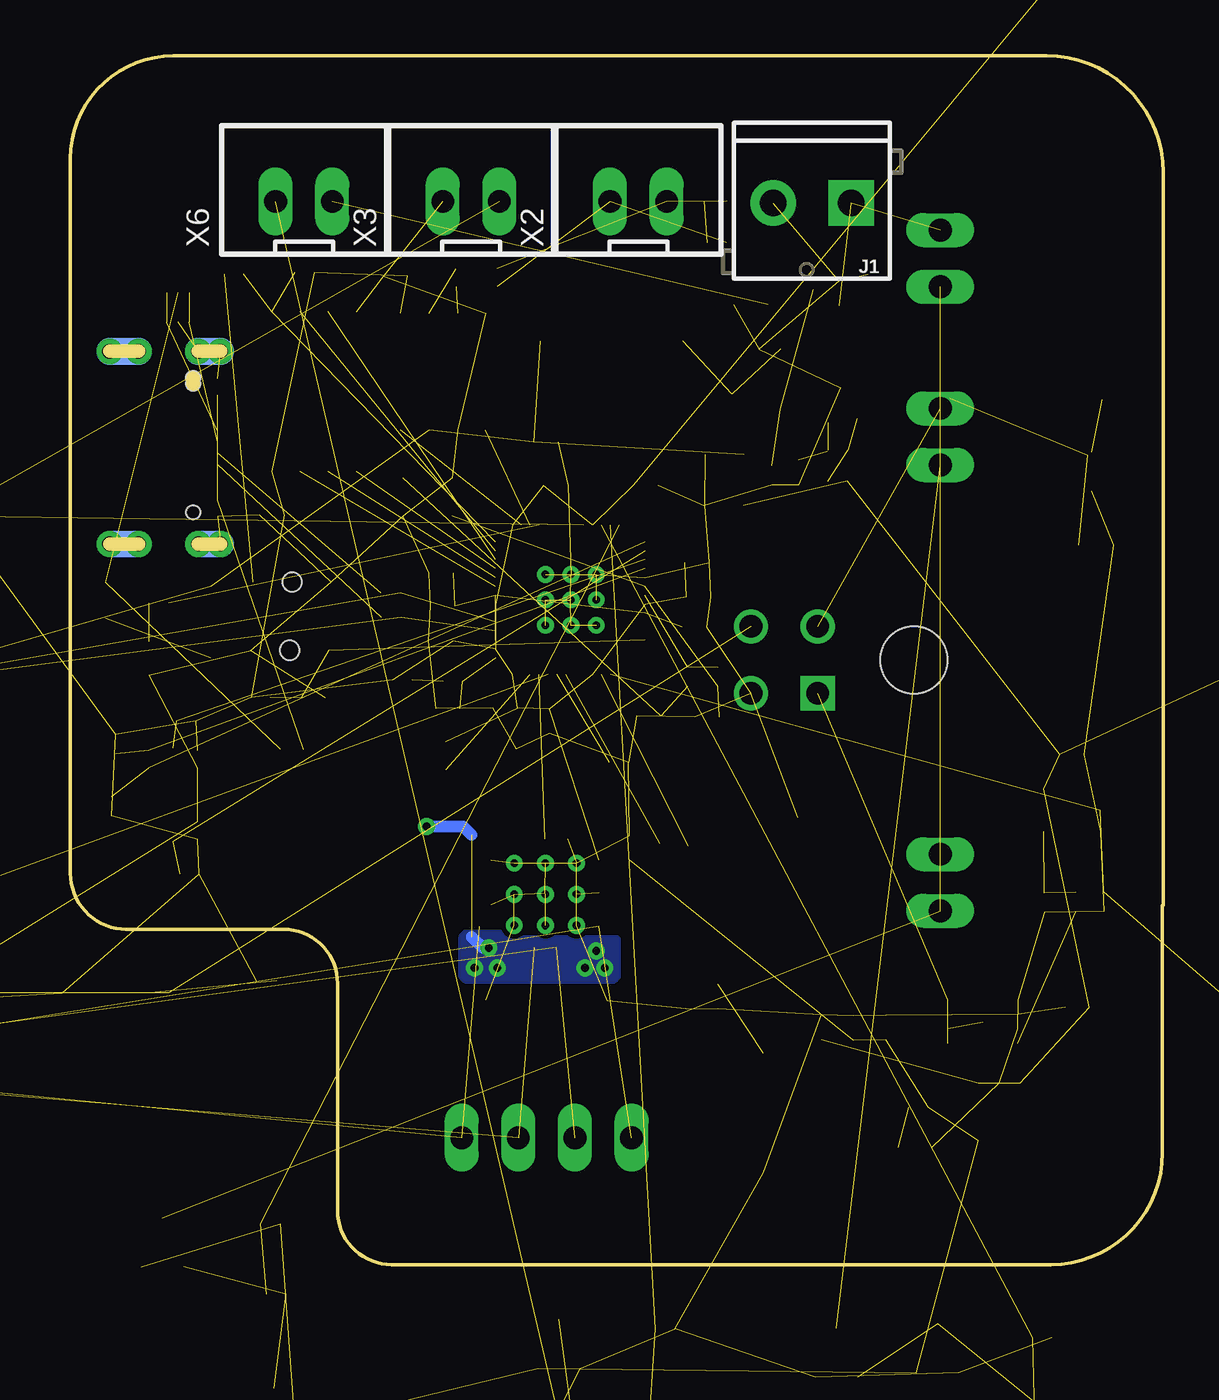
[diagram p3: board, bottom side, seen from below]

Size 49.02 x 54.23 mm. Coordinates in mm from the lower left corner, seen from the top.
Outline: 5.23,54.23 44.4,54.23 arc-90 49.02,49.61 49.02,17.55 arc-90 46.51,15.04 39.45,15.04 arc90 37.03,12.62 37.03,2.41 arc-90 34.62,0 5.03,0 arc-90 0.03,5 0.03,16.1 arc-90 0,16.13 0,49 arc-90 5.23,54.23
Copper layers (1*16): Top 0.035mm / dielectric 1.5mm / Bottom 0.035mm
Design rules "LionCircuits *": minimum track width 8mil, minimum drill 0.35mm, track to track 8mil, track to pad 8mil, pad to pad 6mil, via to via 8mil, smd to smd 6mil, copper to edge 30mil, drill to drill 10mil, minimum pad ring 10mil, minimum via ring 8mil, stop-mask expansion 4mil, vias tented up to drill 0mil, thermal gap 10mil

### Footprints (pad centres in the part's own frame; a part is rotated, then mirrored left to right if it is on the bottom)
PAD.03X.04 = smd 1.016 x 1.016: P$1 0,0
B3U-1000P(M)-B = smd 0.8 x 1.8: 1 -1.75,0; 2 1.75,0 | hole 0.85: 0,0
CAPC1005X60 = smd 0.79 x 0.54: 1 -0.55,0; 2 0.545,0
CAPC1608X85 = smd 0.8 x 0.9: 1 -0.775,0; 2 0.775,0
CAPC2012X110 = smd 1.165 x 1.465: 1 -0.875,0; 2 0.875,0
PANASONIC_D = smd 3.5 x 1.2: + 2.67,0; - -2.67,0
SODFL3718X115 = smd 1.115 x 1.361: 1 -1.6,0; 2 1.6,0
SOT-666_STM-L = smd 0.583 x 0.28: 1 -0.66,0.5; 2 -0.66,0; 3 -0.66,-0.5; 4 0.66,-0.5; 5 0.66,0; 6 0.66,0.5
LEDC1608X35N_FLAT-G = smd 0.612 x 0.912: A 0.75,0; C -0.75,0
SOT23 = smd 1 x 1.4: 1 -0.95,-1.1; 2 0.95,-1.1; 3 0,1.1
FUSC1608X60N = smd 0.799 x 0.974: 1 -0.815,0; 2 0.815,0
FIDUCIAL_1MM = smd 1 x 1: 1 0,0
PAD.03X.03 = smd 0.762 x 0.762: P$1 0,0
SCREWTERMINAL-3.5MM-2 = drill 1.2 pad 2.032 square: 1 0,0 | drill 1.2 pad 2.032: 2 3.5,0
CON_430450400_MOL = drill 1.02 pad 1.52 square: 1 0,0 | drill 1.02 pad 1.52: 2 -3,0; 3 0,3; 4 -3,3 | hole 3: -1.5,-4.32
SMDRI74-680MT = smd 1.6 x 2.2: 1 -3.2,0; 2 3.2,0
ACM2012_TDK = smd 0.762 x 0.406: 1 -0.925,0.406; 2 -0.925,-0.406; 3 0.925,-0.406; 4 0.925,0.406
NMOSFET_WSD3066DN33 = smd 0.75 x 0.35: P$1 -1.575,1; P$2 -1.575,0.35; P$3 -1.575,-0.3; P$4 -1.575,-0.95; P$5 1.575,-0.95; P$6 1.575,-0.3; P$7 1.575,0.35; P$8 1.575,1 | smd 1.4 x 2.4: P$9 0,0
SOT-23-6 = smd 1 x 0.55: 1 -1.35,0.95; 2 -1.35,0; 3 -1.35,-0.95; 4 1.35,-0.95; 5 1.35,0; 6 1.35,0.95
SOT23-5 = smd 0.55 x 1.2: 1 -0.95,-1.3; 2 0,-1.3; 3 0.95,-1.3; 4 0.95,1.3; 5 -0.95,1.3
RESC1005X40 = smd 0.566 x 0.54: 1 -0.433,0; 2 0.433,0
SJ_2S-TRACE = smd 0.635 x 1.27: 1 -0.508,0; 2 0.508,0
SJ_2S-NO = smd 0.635 x 1.27: 1 -0.45,0; 2 0.45,0
IC57_RP2040-L = smd 0.708 x 0.179: 1 -3.351,2.6; 2 -3.351,2.2; 3 -3.351,1.8; 4 -3.351,1.4; 5 -3.351,1; 6 -3.351,0.6; 7 -3.351,0.2; 8 -3.351,-0.2; 9 -3.351,-0.6; 10 -3.351,-1; 11 -3.351,-1.4; 12 -3.351,-1.8; 13 -3.351,-2.2; 14 -3.351,-2.6; 29 3.351,-2.6; 30 3.351,-2.2; 31 3.351,-1.8; 32 3.351,-1.4; 33 3.351,-1; 34 3.351,-0.6; 35 3.351,-0.2; 36 3.351,0.2; 37 3.351,0.6; 38 3.351,1; 39 3.351,1.4; 40 3.351,1.8; 41 3.351,2.2; 42 3.351,2.6 | smd 0.179 x 0.708: 15 -2.6,-3.351; 16 -2.2,-3.351; 17 -1.8,-3.351; 18 -1.4,-3.351; 19 -1,-3.351; 20 -0.6,-3.351; 21 -0.2,-3.351; 22 0.2,-3.351; 23 0.6,-3.351; 24 1,-3.351; 25 1.4,-3.351; 26 1.8,-3.351; 27 2.2,-3.351; 28 2.6,-3.351; 43 2.6,3.351; 44 2.2,3.351; 45 1.8,3.351; 46 1.4,3.351; 47 1,3.351; 48 0.6,3.351; 49 0.2,3.351; 50 -0.2,3.351; 51 -0.6,3.351; 52 -1,3.351; 53 -1.4,3.351; 54 -1.8,3.351; 55 -2.2,3.351; 56 -2.6,3.351 | smd 3.2 x 3.2: 57 0,0
SOIC_128JVSIQ_WIN-L = smd 1.213 x 0.483: 1 -3.595,1.905; 2 -3.595,0.635; 3 -3.595,-0.635; 4 -3.595,-1.905; 5 3.595,-1.905; 6 3.595,-0.635; 7 3.595,0.635; 8 3.595,1.905
D8-L = smd 1.255 x 0.508: 1 -2.621,1.905; 2 -2.621,0.635; 3 -2.621,-0.635; 4 -2.621,-1.905; 5 2.621,-1.905; 6 2.621,-0.635; 7 2.621,0.635; 8 2.621,1.905
ADXL345_LGA14 = smd 1.145 x 0.55: 1 -1.097,2; 2 -1.097,1.2; 3 -1.097,0.4; 4 -1.097,-0.4; 5 -1.097,-1.2; 6 -1.097,-2; 8 1.097,-2; 9 1.097,-1.2; 10 1.097,-0.4; 11 1.097,0.4; 12 1.097,1.2; 13 1.097,2 | smd 0.55 x 1.145: 7 0,-2.098; 14 0,2.098
DBV5-L = smd 0.772 x 0.458: 1 -1.262,0.95; 2 -1.262,0; 3 -1.262,-0.95; 4 1.262,-0.95; 5 1.262,0.95
QFN28_5X5_3X8_EPAD_TRI = smd 0.757 x 0.255: 1 -2.423,1.5; 2 -2.423,1; 3 -2.423,0.5; 4 -2.423,0; 5 -2.423,-0.5; 6 -2.423,-1; 7 -2.423,-1.5; 15 2.423,-1.5; 16 2.423,-1; 17 2.423,-0.5; 18 2.423,0; 19 2.423,0.5; 20 2.423,1; 21 2.423,1.5 | smd 0.255 x 0.757: 8 -1.5,-2.423; 9 -1,-2.423; 10 -0.5,-2.423; 11 0,-2.423; 12 0.5,-2.423; 13 1,-2.423; 14 1.5,-2.423; 22 1.5,2.423; 23 1,2.423; 24 0.5,2.423; 25 0,2.423; 26 -0.5,2.423; 27 -1,2.423; 28 -1.5,2.423 | smd 3.7 x 3.7: 29 0,0
CONN12_016JA1R1500_JAE = smd 0.52 x 1: 1 -3.1,1.1; 2 -2.35,1.1; 11 2.35,1.1; 12 3.1,1.1 | smd 0.27 x 1: 3 -1.75,1.1; 4 -1.25,1.1; 5 -0.75,1.1; 6 -0.25,1.1; 7 0.25,1.1; 8 0.75,1.1; 9 1.25,1.1; 10 1.75,1.1 | smd 1.2 x 2.2: 13 -4.32,0.725; 14 4.32,0.725 | smd 1.2 x 2.5: 15 -4.32,-3.1; 16 4.32,-3.1 | smd 1.2 x 1.9: 18 -1.4,-3.1; 19 1.4,-3.1 | drill 0.65 pad 0.65: 20 -4.32,1.225; 21 -4.32,0.225; 24 4.32,1.225; 25 4.32,0.225; 26 4.32,-2.45; 27 4.32,-3.75; 28 -4.32,-2.45; 29 -4.32,-3.75 | smd 1.2 x 2.5 bottom: 37 -4.32,-3.1; 41 4.32,-3.1 | smd 1.2 x 2.2 bottom: 39 -4.32,0.725; 43 4.32,0.725 | hole 0.6: -2.9,0; 3.125,0; 2.875,0
CRYSTAL_3225 = smd 1.4 x 1.2: P$1 -1.1,-0.85; P$2 1.1,-0.85; P$3 1.1,0.85; P$4 -1.1,0.85
JST-XH-02-PACKAGE-LONG-PAD = drill 1.016 long: 1 -1.27,0; 2 1.27,0
JST-XH-04-PACKAGE-LONG-PAD = drill 1.016 long: 1 -3.81,0; 2 -1.27,0; 3 1.27,0; 4 3.81,0

### Placement (x,y rotation side)
3.3V  -2.75,66.86 0 top  (outside the outline)
5V  -9.09,29.26 0 top  (outside the outline)
24V  2.74,38.79 0 top
A1  68.73,8.56 0 top  (outside the outline)
A2  66.19,8.56 0 top  (outside the outline)
B1  63.65,8.56 0 top  (outside the outline)
B2  61.11,8.56 0 top  (outside the outline)
BOOT  39.08,30.61 0 top
C1  20.45,24.57 0 top
C2  23.07,24.61 180 top
C3  32.41,27.97 0 top
C4  32.38,31.02 0 top
C5  20.92,31.49 180 top
C6  29.51,24.98 0 top
C7  20.86,29.93 180 top
C8  27.52,24.38 270 top
C9  23.21,34.96 180 top
C10  27.24,34.93 180 top
C11  21.04,28.59 180 top
C12  32.32,29.55 0 top
C13  32.08,24.96 0 top
C14  15.32,10.65 90 top
C15  13.89,10.61 90 top
C16  3.85,11.53 0 top
C17  12.43,10.63 90 top
C18  14.55,43.56 90 top
C19  13.23,43.64 90 top
C20  19.34,38.51 90 top
C21  19.68,36.34 0 top
C22  19.7,34.05 0 top
C23  14.28,37.95 0 top
C24  39.98,33.62 0 top
C25  38.12,25.42 0 top
C26  34.43,44.34 0 top
C27  27.7,36.9 180 top
C28  32.15,16.47 270 top
C29  32.17,19.04 270 top
C30  21.17,12 90 top
C31  19.97,12.01 90 top
C32  29.77,23.12 0 top
C33  17.93,6.79 90 top
C34  23.93,18.7 90 top
C38  3.22,35.58 270 top
C39  4.09,22.87 180 top
C40  65.43,13.88 0 top  (outside the outline)
C42  14.47,40.11 270 top
C43  18.51,43.06 0 top
C44  3.01,32.28 180 top
C45  15.62,20.05 0 top
D1  42.73,28.81 270 top
D2  44.19,42.95 90 top
D3  11.13,5.26 0 top
D4  57.53,12.75 0 top  (outside the outline)
D6  10.11,-3.75 0 top
D7  27.09,-3.55 0 top
D8  39.87,-6.65 0 top  (outside the outline)
D9  45.48,27.2 90 top
F1  47.44,29.79 90 top
FD1  66.09,59.06 0 top  (outside the outline)
FD2  63.55,59.06 0 top  (outside the outline)
FD3  61.01,59.06 0 top  (outside the outline)
FD4  58.47,59.06 0 top  (outside the outline)
FD5  55.93,59.06 0 top  (outside the outline)
FD6  53.39,59.06 0 top  (outside the outline)
GND  68.97,11.06 0 top  (outside the outline)
HE0  -20.87,-3.64 0 top  (outside the outline)
IO1  53.09,26.56 0 top  (outside the outline)
IO2  54.55,26.56 0 top  (outside the outline)
IO3  56.01,26.56 0 top  (outside the outline)
J1  14,47.62 180 bottom
J3  15.49,25.63 270 top
L1  24.74,41.43 0 top
L2  30.8,44.28 180 top
M1  8.09,10.87 0 top
M2  14.65,-3.95 0 top
M3  27.21,-7.49 0 top  (outside the outline)
M4  44.89,1.01 0 top
P1  17.18,39.73 270 top
P2  7.34,6.85 180 top
R1  34.12,26.22 0 top
R2  31.86,26.15 0 top
R3  21.33,26.36 90 top
R4  19.98,26.35 270 top
R5  15.68,43.3 270 top
R6  17.55,35.41 90 top
R7  14.6,35.15 180 top
R8  14.58,36.53 180 top
R9  16.35,35.4 90 top
R10  34.64,30.12 180 top
R11  34.63,29.02 180 top
R12  41.67,44.43 0 top
R13  38.52,44.51 180 top
R14  40.48,25.44 0 top
R15  10.96,7.06 180 top
R16  20.01,45.84 0 top
R17  46.99,23.34 90 top
R18  47.16,20.56 270 top
R19  43.67,17.52 180 top
R20  43.81,24.39 180 top
R21  32.62,23.46 0 top
R22  24.41,22.53 0 top
R23  32.59,22.21 180 top
R24  22.57,18.45 270 top
R25  21.3,18.34 270 top
R26  29.94,11.87 180 top
R27  25.35,11.84 0 top
R28  45.05,29.68 180 top
R30  5.32,16.23 90 top
R31  3.92,16.26 90 top
R33  48.96,12.18 0 top
R34  45.03,12.18 0 top
R35  52.78,12.18 0 top  (outside the outline)
R36  61.73,13.78 0 top  (outside the outline)
R37  2.66,16.27 90 top
R40  58.87,33.63 0 top  (outside the outline)
R41  54.49,33.43 0 top  (outside the outline)
R44  5.32,-6.87 0 top  (outside the outline)
R45  5.41,-3.27 0 top  (outside the outline)
R46  22.67,-8.07 0 top  (outside the outline)
R47  22.33,-2.87 0 top
R48  39.78,-1.32 0 top
R49  40.05,1.83 0 top
RST  39.18,27.56 180 top
SJ1  20.08,47.7 0 top
SJ2  40.21,12.73 0 top
SJ3  39.07,23.11 180 top
TH0  68.87,13.96 0 top  (outside the outline)
U1  26.59,29.82 270 top
U2  38.09,39.16 270 top
U3  32.3,40.05 90 top
U5  44.41,21.07 0 top
U6  4.08,20.37 0 top
U7  27.72,16.66 180 top
USB  43.51,36.65 90 top
X1  33.01,34.42 0 top
X2  23.54,47.69 0 bottom
X3  31.04,47.69 0 bottom
X4  27.65,5.69 0 top
X5  9.99,37.14 90 top
X6  38.54,47.69 0 bottom
X7  9.99,45.14 90 top
X8  9.99,17.14 90 top

### Tracks (layer width: path | path; a pad name or v marks a point on that pad's centre or on a via)
+1.1V  (5 unrouted)
+3.3V  (41 unrouted)
  Top 0.305: C34.1 U7.15
+5V  (13 unrouted)
  Top 0.305: C22.1 18.82,33.8 18.8,33.82 C21.1 18.8,33.88
+24V  (via drill 0.35)  (9 unrouted)
  Top 0.305: 9.43,46.96 X7.2 | 9.56,38.84 X5.2 | 7.07,18.96 7.63,18.41 | 21.16,12.56 C30.2 | U7.22 26.22,13.6 v25.93,13.31 | 3.37,36.3 C38.1
  Top 0.508: C29.1 32.98,19.59 v33.05,19.66
  Bottom 0.508: v33.05,19.66 31.39,19.66 31.01,19.28 | 31.01,14.71 30.51,14.2 v30.25,14.2
  other vias: 25.04,13.31 25.43,14.07 30.89,13.31 29.87,13.31
  pour Top: 6.63,33.25 6.63,17.12 6.76,16.99 12.6,16.99 13.74,15.85 14.5,15.09 14.5,13.31 18.06,13.31 18.31,13.06 19.08,12.29 21.87,12.29 22.38,12.29 22.89,12.8 26.06,12.8 26.31,13.06 26.31,14.45 18.44,14.45 18.19,14.71 17.81,15.09 17.81,18.26 17.17,18.9 15.77,18.9 13.74,20.93 13.74,27.15 14,27.41 16.15,27.41 16.79,28.04 16.79,30.07 13.61,33.25
  pour Bottom: 24.54,14.58 24.54,12.93 24.66,12.8 31.27,12.8 31.39,12.93 31.39,14.71 31.27,14.83 28.73,14.83 28.47,14.58
  pour Top: 30.51,14.58 29.24,14.58 29.11,14.45 29.11,13.06 29.36,12.8 31.01,12.8 31.39,13.18 31.39,13.69
  pour Top: 8.28,41.38 8.28,37.57 8.53,37.31 12.09,37.31 12.47,37.69 12.47,39.73 12.98,40.23 16.28,40.23 16.54,40.49 16.54,41.76 16.92,42.14 18.57,42.14 18.69,42.9 18.69,44.17 17.04,44.17 16.03,43.15 15.01,43.15 14.63,43.54 12.47,43.54 12.47,42.27 11.71,41.5 8.41,41.5
A1  (2 unrouted)
A2  (2 unrouted)
ADC_AVDD  (2 unrouted)
ADC_R  (1 unrouted)
B1  (2 unrouted)
B2  (2 unrouted)
  Top 0.254: U7.1 30.69,15.16
BCBOOT
  Top 0.305: P1.6 18.54,37.96 C20.1
BRA
  Top 0.305: U7.23 26.72,12.44 26.11,11.84 R27.2
BRB
  Top 0.305: U7.27 28.72,12.3 29.15,11.87 R26.2
CAN1_N  (1 unrouted)
CAN1_P  (1 unrouted)
CAN_N  (2 unrouted)
CAN_P  (2 unrouted)
CAN_RX  (1 unrouted)
CAN_TX  (1 unrouted)
CNT  (1 unrouted)
DIR
  Top 0.254: U7.19 22.19,16.16 21.3,17.06 R25.2
E0_DIAG  (1 unrouted)
E0_DIR  (1 unrouted)
E0_EN  (1 unrouted)
E0_STEP  (1 unrouted)
E0_UART  (1 unrouted)
  Top 0.305: R22.2 26.22,21.15 U7.14
ENDSTOP_X  (1 unrouted)
EX  (2 unrouted)
FAN0  (2 unrouted)
FAN0G  (2 unrouted)
FAN1  (2 unrouted)
FAN1D  (1 unrouted)
FAN1G  (2 unrouted)
FAN2  (2 unrouted)
FAN2G  (2 unrouted)
GND  (via drill 0.35)  (104 unrouted)
  other vias: 25.43,30.96 26.57,30.96 27.71,30.96 25.43,29.82 26.57,29.82 27.71,29.82 25.43,28.68 26.57,28.68 27.71,28.68 26.31,18.01 27.71,18.01 29.11,18.01 29.11,16.61 27.71,16.61 26.31,16.61 26.31,15.21 27.71,15.21 29.11,15.21
  pour Top: 3.19,48.04 arc-90 4.99,46.24 4.99,46.14 arc-90 3.09,44.24 2.89,44.24 arc-90 1.09,46.04 1.09,46.14 arc-90 3.09,48.04
  cutout Top: 46.09,48.14 arc-90 47.99,46.24 arc-90 45.99,44.24 arc-90 44.04,46.19 arc-90 45.99,48.14
  cutout Top: 2.99,10.04 arc-90 5.09,7.94 arc-90 3.09,5.94 2.99,5.94 arc-90 0.99,7.94 0.99,8.24 arc-90 2.79,10.04
  cutout Bottom: 3.09,48.04 arc-90 4.99,46.14 arc-90 3.09,44.24 2.89,44.24 arc-90 1.09,46.04 arc-90 3.09,48.04 3.19,48.04
  cutout Bottom: 46.09,48.14 arc-90 47.99,46.24 arc-90 45.99,44.24 45.79,44.24 arc-90 43.99,46.04 arc-90 46.09,48.14 46.19,48.14
  cutout Bottom: 2.89,10.04 arc-90 5.09,7.84 5.09,7.74 arc-90 3.29,5.94 2.79,5.94 arc-90 0.99,7.74 0.99,8.14 arc-90 2.89,10.04 2.99,10.04
GPIOLED  (1 unrouted)
HE0  (3 unrouted)
HE0_PWR  (5 unrouted)
HE0A  (2 unrouted)
HE0B  (1 unrouted)
LDOLED  (1 unrouted)
LED  (1 unrouted)
N$1  (1 unrouted)
N$2  (2 unrouted)
OSC_IN  (3 unrouted)
OSC_OUT  (2 unrouted)
QSPI_SCK  (1 unrouted)
QSPI_SD0  (1 unrouted)
QSPI_SD1  (1 unrouted)
QSPI_SD2  (1 unrouted)
QSPI_SD3  (1 unrouted)
QSPI_SS  (3 unrouted)
RESET  (3 unrouted)
SPI1_CS  (2 unrouted)
SPI1_MISO  (2 unrouted)
SPI1_MOSI  (2 unrouted)
SPI1_SCK  (2 unrouted)
STEP
  Top 0.254: U7.16 24.7,17.66 24.28,17.25 23.01,17.25 22.57,17.69 R24.2
SWB  (1 unrouted)
TH0  (3 unrouted)
TH0A  (3 unrouted)
TH0B  (2 unrouted)
TH0C  (1 unrouted)
TMC5V
  Top 0.305: C32.2 29.22,21.79 U7.8
TMCCPI
  Top 0.305: U7.5 32.01,17.16 C28.1
TMCCPO
  Top 0.305: U7.4 31.34,16.66 32.07,15.93 C28.2
TMCENN
  Top 0.305: R23.1 33.06,22.24 | 33.06,22.24 R21.2 | U7.2 31.24,15.66 31.73,15.17 33.26,15.17 33.81,15.72 33.81,21.95 33.52,22.24 33.06,22.24
TMCVCP
  Top 0.305: U7.6 31.34,17.66 C29.2
USB1_N  (4 unrouted)
USB1_P  (4 unrouted)
USB_N  (2 unrouted)
USB_P  (2 unrouted)
VBUS  (2 unrouted)
VBUS1  (2 unrouted)
VBUS2  (1 unrouted)
VRC  (2 unrouted)
VREGEN  (2 unrouted)
VREGFB  (2 unrouted)
  Top 0.305: P1.4 15.8,37.95 C23.2 15.01,37.76 | R8.1 15.06,36.48 | 16.35,36.1 R9.2
VREGO  (2 unrouted)
XR  (2 unrouted)

### Text on the board
tPlace: FLASH | LDO | MCU | FIDUCIAL | BUTTONS | ACCELEROMETER | BUCK | UMBILICAL CONNECTORS | USB | CAN | TOOLHEAD CONNECTORS | STEPPER DRIVER | FAN2&3 | HOTEND HEATER | FAN1 | CRYSTAL | FAN0